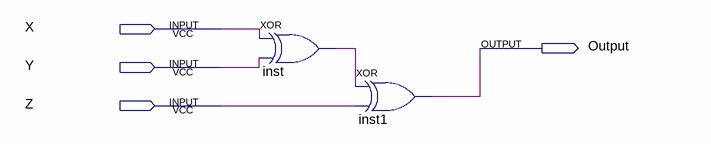
[diagram p0: schematic sheet]
// Quartus schematic Project.bdf as structural Verilog: 2 symbols, 4 pins
module Project (
  input  X,
  input  Y,
  input  Z,
  output Output
);

  wire inst_out;

  xor inst (inst_out, X, Y);
  xor inst1 (Output, inst_out, Z);
endmodule
